# EAGLE design ip_simple (EAGLE 6.5.0)
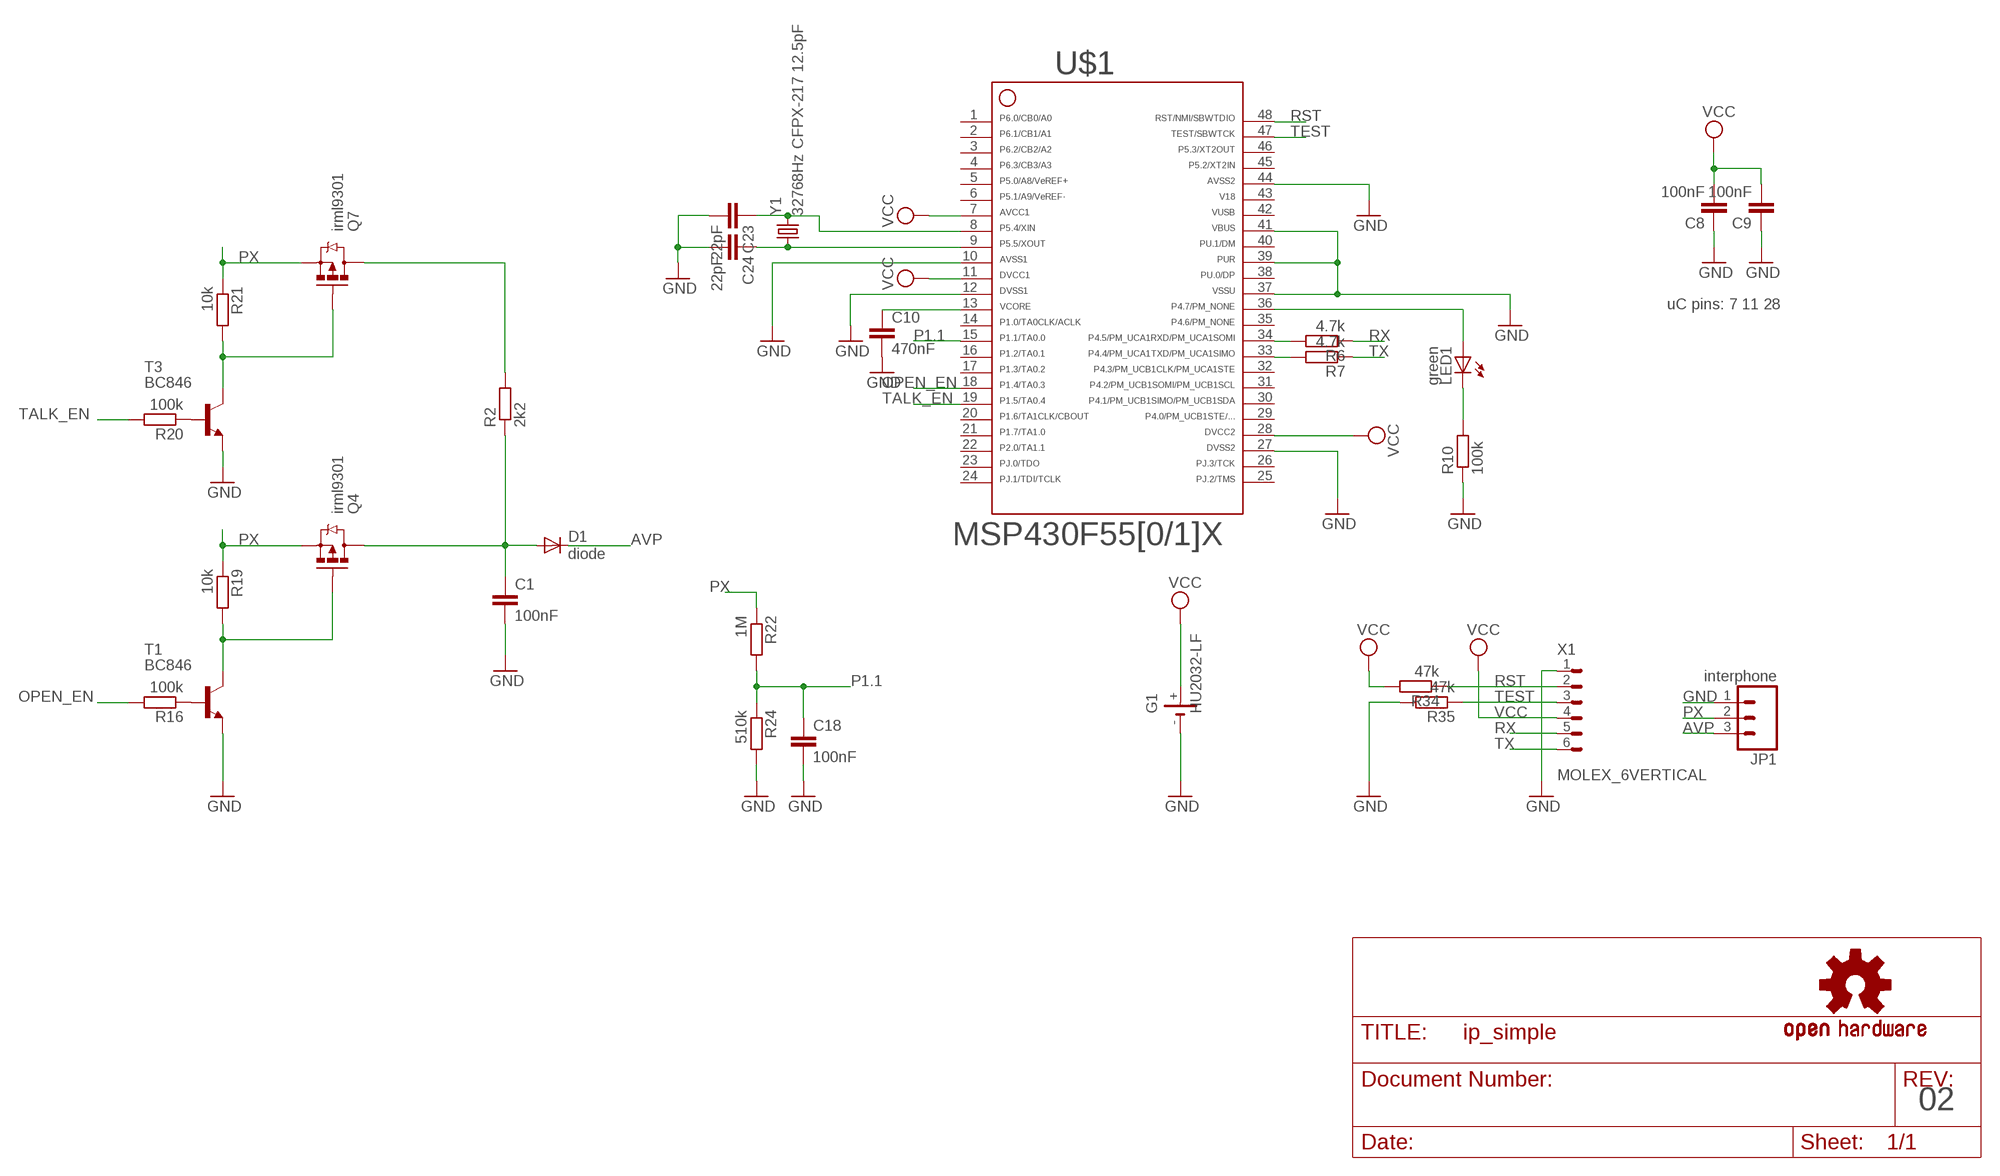
[diagram p0: schematic, sheet 1]

## Parts
C1  100nF  C-EUC0805  [C0805]
C8  100nF  C-EUC0805  [C0805]
C9  100nF  C-EUC0805  [C0805]
C10  470nF  C-EUC0805  [C0805]
C18  100nF  C-EUC0805  [C0805]
C23  22pF  C-EUC0805  [C0805]
C24  22pF  C-EUC0805  [C0805]
D1  diode  DIODESMA  [SMA-DIODE]
G1  HU2032-LF  [HU2032-LF]
JP1  interphone  M03PTH  [1X03]
LED1  green  LEDCHIP-LED0805  [CHIP-LED0805]
Q4  irml9301  MOSFET-PCHANNELSMD_POWER  [SOT23-3_POWER]
Q7  irml9301  MOSFET-PCHANNELSMD_POWER  [SOT23-3_POWER]
R2  2k2  R-EU_R0805W  [R0805W]
R6  4.7k  R-EU_R0805W  [R0805W]
R7  4.7k  R-EU_R0805W  [R0805W]
R10  100k  R-EU_R0805W  [R0805W]
R16  100k  R-EU_R0805W  [R0805W]
R19  10k  R-EU_R0805W  [R0805W]
R20  100k  R-EU_R0805W  [R0805W]
R21  10k  R-EU_R0805W  [R0805W]
R22  1M  R-EU_R0805W  [R0805W]
R24  510k  R-EU_R0805W  [R0805W]
R34  47k  R-EU_R0805W  [R0805W]
R35  47k  R-EU_R0805W  [R0805W]
T1  BC846  [SOT23]
T3  BC846  [SOT23]
U$1  F55[0/1]X---PT48  [PT48]
U$7  OSHW-LOGOM  [OSHW-LOGO-M]
X1  MOLEX_6VERTICAL  [0530470610]
Y1  32768Hz CFPX-217 12.5pF  CRYSTAL3.2X1.5  [CRYSTAL-SMD-3.2X1.5]

## Nets
AVP: D1.C JP1.3
GND: C1.2 C8.1 C9.1 C10.2 C18.2 C23.2 C24.2 G1.- JP1.1 R10.1 R24.2 R35.2 T1.2(E) T3.2(E) U$1.10 U$1.12 U$1.27 U$1.37 U$1.39 U$1.41 U$1.44 X1.1
LED: LED1.A U$1.36
N$1: LED1.C R10.2
N$3: R16.1 T1.1(B)
N$4: C1.1 D1.A Q4.3(D) R2.1
N$5: Q7.3(D) R2.2
N$6: C10.1 U$1.13
N$11: R6.2 U$1.34
N$13: R7.2 U$1.33
N$25: C24.1 U$1.9 Y1.P$1
N$26: C23.1 U$1.8 Y1.P$2
N$28: Q4.1(G) R19.2 T1.3(C)
N$31: R20.1 T3.1(B)
N$32: Q7.1(G) R21.2 T3.3(C)
OPEN_EN: R16.2 U$1.18
P1.1: C18.1 R22.2 R24.1 U$1.15
PX: JP1.2 Q4.2(S) Q7.2(S) R19.1 R21.1 R22.1
RST: R34.1 U$1.48 X1.2
RX: R6.1 X1.5
TALK_EN: R20.2 U$1.19
TEST: R35.1 U$1.47 X1.3
TX: R7.1 X1.6
VCC: C8.2 C9.2 G1.+ R34.2 U$1.7 U$1.11 U$1.28 X1.4
Unconnected: G1.+@1(+) U$1.1 U$1.2 U$1.3 U$1.4 U$1.5 U$1.6 U$1.14 U$1.16 U$1.17 U$1.20 U$1.21 U$1.22 U$1.23 U$1.24 U$1.25 U$1.26 U$1.29 U$1.30 U$1.31 U$1.32 U$1.35 U$1.38 U$1.40 U$1.45

## Notes on the sheet
- uC pins: 7 11 28
- 02

## Power pins joined to a net without a drawn wire
42: U$1.42
43: U$1.43
46: U$1.46

## Library data of the parts
C1 C8-C10 C18 C23 C24 = rcl:C-EU: CAPACITOR, European symbol
D1 = SparkFun-DiscreteSemi:DIODE: Diode These are standard reverse protection diodes and small signal diodes. SMA package can handle up to about 1A. SOD-323 can handle about 200mA. What the SOD-323 package when ordering, there are some mfgs out there that are 5-pin packages.
G1 = Simplex-Battery:HU2032-LF: Renata HU2032 Li battery holder
JP1 = SparkFun-Connectors:M03: Header 3 Standard 3-pin 0.1" header. Use with straight break away headers (SKU : PRT-00116), right angle break away headers (PRT-00553), swiss pins (PRT-00743), machine pins (PRT-00117), and female headers (PRT-00115). Molex polarized connector foot print use with SKU : PRT-08232 with associated crimp pins and housings.
LED1 = led:LED: LED OSRAM: - CHIPLED LG R971, LG N971, LY N971, LG Q971, LY Q971, LO R971, LY R971 LH N974, LH R974 LS Q976, LO Q976, LY Q976 LO Q996 - Hyper CHIPLED LW Q18S LB Q993, LB Q99A, LB R99A - SideLED LS A670, LO A670, LY A670, LG A670, LP A670 LB A673, LV A673, LT A673, LW A673 LH A674 LY A675 LS A676, LA A676, LO A676, LY A676, LW A676 LS A679, LY A679, LG A679 - Hyper Micro SIDELED® LS Y876, LA Y876, LO Y876, LY Y876 LT Y87S - SmartLED LW L88C, LW L88S LB L89C, LB L89S, LG L890 LS L89K, LO L89K, LY L89K LS L896, LA L896, LO L896, LY L896 - TOPLED LS T670, LO T670, LY T670, LG T670, LP T670 LSG T670, LSP T670, LSY T670, LOP T670, LYG T670 LG T671, LOG T671, LSG T671 LB T673, LV T673, LT T673, LW T673 LH T674 LS T676, LA T676, LO T676, LY T676, LB T676, LH T676, LSB T676, LW T676 LB T67C, LV T67C, LT T67C, LS T67K, LO T67K, LY T67K, LW E67C LS E67B, LA E67B, LO E67B, LY E67B, LB E67C, LV E67C, LT E67C LW T67C LS T679, LY T679, LG T679 LS T770, LO T770, LY T770, LG T770, LP T770 LB T773, LV T773, LT T773, LW T773 LH T774 LS E675, LA E675, LY E675, LS T675 LS T776, LA T776, LO T776, LY T776, LB T776 LHGB T686 LT T68C, LB T68C - Hyper Mini TOPLED® LB M676 - Mini TOPLED Santana® LG M470 LS M47K, LO M47K, LY M47K Source: http://www.osram.convergy.de LUXEON: - LUMILED® LXK2-PW12-R00, LXK2-PW12-S00, LXK2-PW14-U00, LXK2-PW14-V00 LXK2-PM12-R00, LXK2-PM12-S00, LXK2-PM14-U00 LXK2-PE12-Q00, LXK2-PE12-R00, LXK2-PE12-S00, LXK2-PE14-T00, LXK2-PE14-U00 LXK2-PB12-K00, LXK2-PB12-L00, LXK2-PB12-M00, LXK2-PB14-N00, LXK2-PB14-P00, LXK2-PB14-Q00 LXK2-PR12-L00, LXK2-PR12-M00, LXK2-PR14-Q00, LXK2-PR14-R00 LXK2-PD12-Q00, LXK2-PD12-R00, LXK2-PD12-S00 LXK2-PH12-R00, LXK2-PH12-S00 LXK2-PL12-P00, LXK2-PL12-Q00, LXK2-PL12-R00 Source: www.luxeon.com KINGBRIGHT: KA-3528ASYC Source: www.kingbright.com
Q4 Q7 = Simplex-DiscreteSemi:MOSFET-PCHANNEL: Generic PMOSFET
R2 R6 R7 R10 R16 R19-R22 R24 R34 R35 = rcl:R-EU_: RESISTOR, European symbol
T1 T3 = transistor:BC846: NPN TRANSISTOR
U$1 = TI_MSP430_v16:F55[0/1]X---PT48: ***F55[0/1/2]X*** PT48 Rev. 1.0 06/2010 "http://www.ti.com/lit/gpn/msp430f5509" Only for FF5504, F5508,F5509,F5510
U$7 = SparkFun:OSHW-LOGO: Open Source Hardware Logo This logo indicates the piece of hardware it is found on incorporates a OSHW license and/or adheres to the definition of open source hardware found here: http://freedomdefined.org/OSHW
X1 = Simplex-Connectors:MOLEX_6: Molex 6 pin connectors 1.25mm PicoBlade
Y1 = Simplex-FreqCtrl:CRYSTAL: smd crystals

## Net classes
1 vcc: width 0.203 mm

## Board
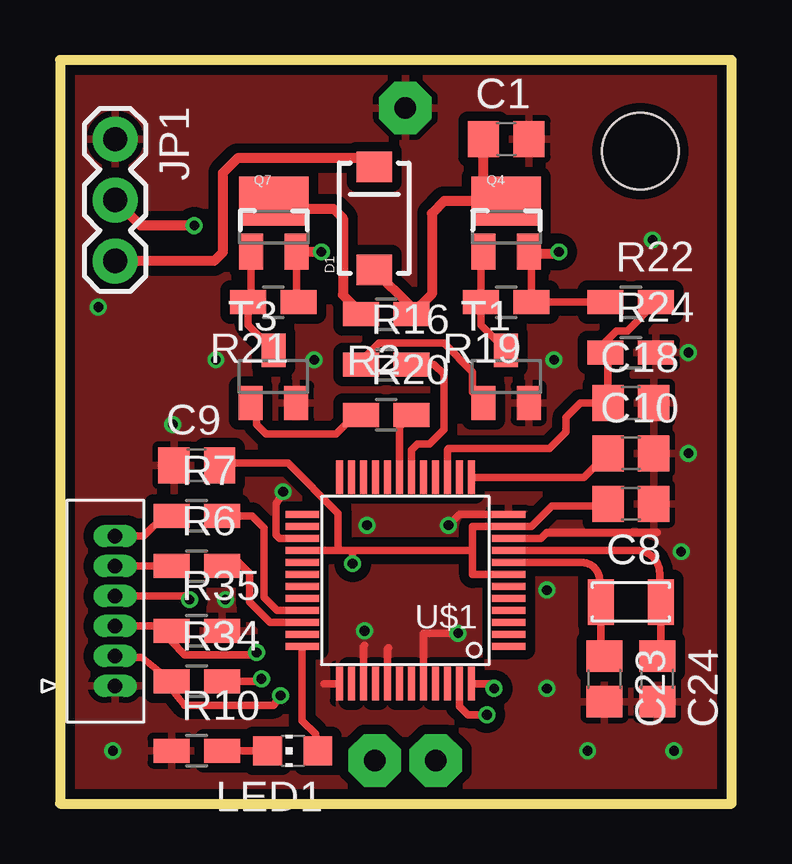
[diagram p1: board, top side]
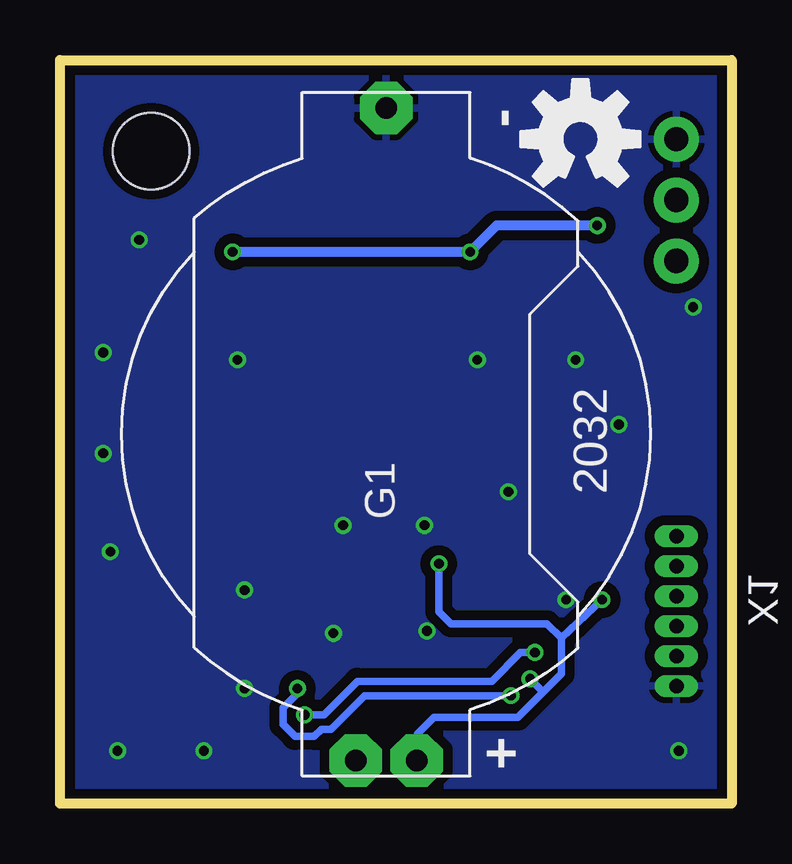
[diagram p2: board, bottom side, seen from below]

Size 28 x 31 mm. Coordinates in mm from the lower left corner, seen from the top.
Outline: 0,0 28,0 28,31 0,31 0,0
Copper layers (1*16): Top 0.035mm / dielectric 1.5mm / Bottom 0.035mm
Design rules "seeedstudio_rules_v1.1 *": minimum track width 6mil, minimum drill 12mil, track to track 6mil, track to pad 6mil, pad to pad 6mil, via to via 6mil, smd to smd 0mil, copper to edge 10mil, drill to drill 10mil, minimum pad ring 0.154mm, minimum via ring 6mil, stop-mask expansion 2mil, vias tented up to drill 100mil, thermal gap 10mil
Holes 3.2 mm at 24.2,27.2

### Footprints (pad centres in the part's own frame; a part is rotated, then mirrored left to right if it is on the bottom)
C0805 = smd 1.3 x 1.5: 1 -0.95,0; 2 0.95,0
SMA-DIODE = smd 1.27 x 1.47: A -2.15,0; C 2.15,0
HU2032-LF = drill 0.9 pad 2.184 octagon: + -13.6,-1.27; +@1 -13.6,1.27; - 13.6,0
1X03 = drill 1.016 pad 1.88: 1 0,0; 2 2.54,0; 3 5.08,0
CHIP-LED0805 = smd 1.2 x 1.2: A 0,-1.05; C 0,1.05
SOT23-3_POWER = smd 1 x 1.5: 1 -0.939,-1.384; 2 0.961,-1.384 | smd 2.9 x 2.05: 3 0.011,0.716
R0805W = smd 1.5 x 1: 1 -1.052,0; 2 1.052,0
SOT23 = smd 1 x 1.4: 1 -0.95,-1.1; 2 0.95,-1.1; 3 0,1.1
PT48 = smd 1.4 x 0.3: 1 -4.3,2.75; 2 -4.3,2.25; 3 -4.3,1.75; 4 -4.3,1.25; 5 -4.3,0.75; 6 -4.3,0.25; 7 -4.3,-0.25; 8 -4.3,-0.75; 9 -4.3,-1.25; 10 -4.3,-1.75; 11 -4.3,-2.25; 12 -4.3,-2.75; 25 4.3,-2.75; 26 4.3,-2.25; 27 4.3,-1.75; 28 4.3,-1.25; 29 4.3,-0.75; 30 4.3,-0.25; 31 4.3,0.25; 32 4.3,0.75; 33 4.3,1.25; 34 4.3,1.75; 35 4.3,2.25; 36 4.3,2.75 | smd 0.3 x 1.4: 13 -2.75,-4.3; 14 -2.25,-4.3; 15 -1.75,-4.3; 16 -1.25,-4.3; 17 -0.75,-4.3; 18 -0.25,-4.3; 19 0.25,-4.3; 20 0.75,-4.3; 21 1.25,-4.3; 22 1.75,-4.3; 23 2.25,-4.3; 24 2.75,-4.3; 37 2.75,4.3; 38 2.25,4.3; 39 1.75,4.3; 40 1.25,4.3; 41 0.75,4.3; 42 0.25,4.3; 43 -0.25,4.3; 44 -0.75,4.3; 45 -1.25,4.3; 46 -1.75,4.3; 47 -2.25,4.3; 48 -2.75,4.3
0530470610 = drill 0.6 pad 0.813 long: 1 0,0; 2 1.25,0; 3 2.5,0; 4 3.75,0; 5 5,0; 6 6.25,0
CRYSTAL-SMD-3.2X1.5 = smd 1.1 x 1.9: P$1 -1.25,0; P$2 1.25,0

### Placement (x,y rotation side)
C1  18.6,27.7 0 top
C8  23.8,12.5 180 top
C9  5.7,14.1 0 top
C10  23.8,14.6 0 top
C18  23.8,16.7 0 top
C23  22.7,5.2 270 top
C24  24.9,5.2 270 top
D1  13.1,24.4 90 top
G1  14.4,15.4 90 bottom
JP1  2.3,27.7 270 top
LED1  9.7,2.2 90 top
Q4  18.6,24.4 0 top
Q7  8.9,24.4 0 top
R2  13.6,20.4 180 top
R6  5.7,9.9 0 top
R7  5.7,12 0 top
R10  5.7,2.2 0 top
R16  13.6,18.3 0 top
R19  18.6,20.9 180 top
R20  13.6,16.2 0 top
R21  8.9,20.9 180 top
R22  23.8,20.9 0 top
R24  23.8,18.8 0 top
R34  5.7,5.1 0 top
R35  5.7,7.2 0 top
T1  18.6,17.8 0 top
T3  8.9,17.8 0 top
U$1  14.4,9.3 180 top
U$7  6.3,27.7 0 bottom
X1  2.3,4.9 90 top
Y1  23.8,8.4 180 top

### Tracks (layer width: path | path; a pad name or v marks a point on that pad's centre or on a via)
AVP
  Top 0.406: D1.C 12.75,26.9 7.4,26.9 6.8,26.3 6.8,23 6.42,22.62 JP1.3
GND  (via drill 0.4)
  Top 0.305: U$1.10 20.05,11.05 20.3,11.3 24.9,11.3 | U$1.12 16.65,12.05 v16.2,11.6 | U$1.44 15.15,7.05 arc-90 15.2,7.1 v16.6,7.1 | U$1.27 9.15,11.05 9,11.2 9,12.5 v9.3,13 | U$1.37 11,5 | U$1.41 13.65,6.45 13.7,6.5 | U$1.39 12.65,6.55 12.7,6.6
  other vias: 24.7,23.5 6.9,8.5 26.2,18.8 25.9,10.5 2.2,2.2 25.6,2.2 20.3,4.8 12.7,7.2 12.8,11.6 20.3,8.9 4.7,15.8 22,2.2 6.5,18.5 1.6,20.7 26.2,14.6 10.6,18.5 20.6,18.5
  pour Top (isolate 0.406): 0,31 0,0 28,0 28,31
  pour Bottom (isolate 0.406): 0,31 0,0 28,0 28,31
LED
  Top 0.305: U$1.36 10.1,3.45 10.65,2.9 LED1.A
N$1
  Top 0.305: R10.2 LED1.C
N$3
  Top 0.305: R16.1 12.55,18.45 13.3,19.2 16,19.2 17.2,18 17.2,17.15 T1.1
N$4
  Top 0.305: R2.1 14.65,20.7
  Top 0.406: 14.65,20.7 D1.A | R2.1 15.5,21.25 15.5,24.6 16.02,25.12 Q4.3 17.65,26.08 C1.1
N$5
  Top 0.305: Q7.3 9.23,24.8 | 12.55,20.45 R2.2
  Top 0.406: 9.23,24.8 11.4,24.8 11.8,24.4 11.8,21.2 12.55,20.45
N$6
  Top 0.305: U$1.13 21.85,13.6 C10.1
N$11
  Top 0.305: U$1.34 8.75,7.55 7.9,8.4 7.9,9.6 7.3,10.2 R6.2
N$13
  Top 0.305: U$1.33 9.05,8.05 8.5,8.6 8.5,11.5 8,12 R7.2
N$25
  Top 0.305: C24.1 25.05,6.6 Y1.P$1 25,8.45 25,9.6 arc90 24.05,10.55 U$1.9
N$26
  Top 0.305: U$1.8 21.75,10.05 arc-90 22.5,9.3 22.5,8.45 Y1.P$2 22.55,6.6 C23.1
N$28
  Top 0.305: Q4.1 17.55,22.9 R19.2 17.55,19.95 T1.3
N$31
  Top 0.305: T3.1 8.2,16.45 8.2,15.8 8.6,15.4 11.5,15.4 12.3,16.2 R20.1
N$32
  Top 0.305: T3.3 7.85,19.95 R21.2 7.96,21.01 Q7.1
OPEN_EN
  Top 0.305: U$1.18 14.65,14.75 14.9,15 15.4,15 16,15.6 16,17.9 15.6,18.3 R16.2
P1.1
  Top 0.305: U$1.15 16.15,14.75 16.2,14.8 20.4,14.8 21.1,15.5 21.1,16.1 21.7,16.7 C18.1 22.85,18.7 R24.1 22.75,19.25 23.2,19.7 23.65,19.7 R22.2
PX  (via drill 0.4)
  Top 0.305: Q4.2 19.65,22.93 R19.1 R22.1 | R21.1 9.86,20.99 Q7.2 | 10.9,23.02 v10.9,23 | 20.8,22.93 v20.8,23
  Top 0.406: Q7.2 10.9,23.02 | 19.65,22.93 20.8,22.93 | v5.6,24.1 3.36,24.1 JP1.2
  Bottom 0.406: v20.8,23 v10.9,23 9.8,24.1 v5.6,24.1
RST  (via drill 0.4)
  Top 0.305: U$1.48 17.9,5 v18.1,4.8 | v9.2,4.5 8.9,4.1 5.2,4.1 4.65,4.75 R34.1 3.4,6.1 2.3,6.1 X1.2
  Bottom 0.305: v9.2,4.5 15.3,4.5 16.7,3.1 17.1,3.1 17.4,2.8 18.2,2.8 18.7,3.3 18.7,4 18.1,4.6 v18.1,4.8
RX
  Top 0.305: R6.1 X1.5
TALK_EN
  Top 0.305: U$1.19 14.15,15.7 R20.2
TEST  (via drill 0.4)
  Top 0.305: R35.1 4.9,7.4 | U$1.47 16.65,4.05 17,3.7 v17.8,3.7 | R35.1 4.65,6.75 5.2,6.2 8.1,6.2 v8.2,6.3 | R35.1 4.45,7.4 X1.3
  Bottom 0.305: v8.2,6.3 8.8,6.3 10,5.1 15.6,5.1 17,3.7 v17.8,3.7
TX
  Top 0.305: R7.1 4.35,12 3.5,11.15 X1.6
VCC  (via drill 0.4)
  Top 0.305: 22.8,12.5 C8.2 22.75,12.4 20.5,12.4 19.65,11.55 U$1.11 17.2,11.55 17.2,10.4 | U$1.7 17.2,9.55 17.2,10.4 | U$1.28 11.7,10.55 | 11.7,10.55 12.2,10.55 | 12.2,10.55 17.05,10.55 arc-90 17.2,10.4 | 11.7,10.55 11.6,10.65 11.6,12.1 9.5,14.2 6.75,14.2 C9.2 | v12.2,10 12.2,10.55 | v8.4,5.2 8.3,5.1 R34.2 | v5.4,8.5 5.25,8.65 X1.4
  Bottom 0.305: 7.1,6.9 7.1,5.4 7.8,4.7 | 7.1,6.9 7.7,7.5 11.7,7.5 12.2,8 v12.2,10 | 7.1,6.9 v5.4,8.5 | 13.1,1.77 13.1,2.9 12.4,3.6 8.9,3.6 7.8,4.7 | v8.4,5.2 7.9,4.7 7.8,4.7 | 13.1,1.63 13.1,1.77 | 13.1,1.77 G1.+

### Text on the board
tmine: mp | px | avp | tx | rx | vcc | test | rst | gnd
bmine: http://github.com/rodan/interphone | ip rev 2.0 201312